# EAGLE design ina333 (EAGLE 8.2.2)
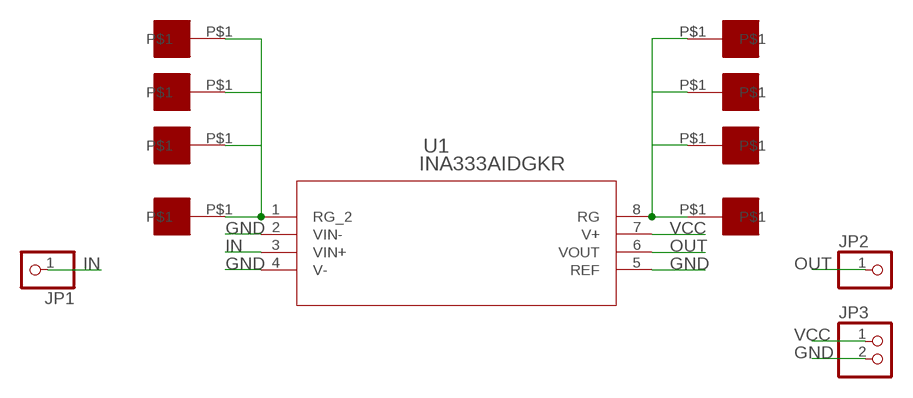
[diagram p0: schematic, sheet 1]

## Parts
JP1  PINHD-1X1  [1X01]
JP2  PINHD-1X1  [1X01]
JP3  PINHD-1X2  [1X02]
U1  INA333AIDGKR  [DGK8]
U$1  PAD  [PAD]
U$2  PAD  [PAD]
U$3  PAD  [PAD]
U$4  PAD  [PAD]
U$5  PAD  [PAD]
U$6  PAD  [PAD]
U$7  PAD  [PAD]
U$8  PAD  [PAD]

## Nets
GND: JP3.2 U1.2(VIN-) U1.4(V-) U1.5(REF)
IN: JP1.1 U1.3(VIN+)
N$1: U1.1(RG_2) U$1.P$1 U$3.P$1 U$5.P$1 U$6.P$1
N$2: U1.8(RG) U$2.P$1 U$4.P$1 U$7.P$1 U$8.P$1
OUT: JP2.1 U1.6(VOUT)
VCC: JP3.1 U1.7(V+)

## Library data of the parts
JP1 JP2 = pinhead:PINHD-1X1: PIN HEADER
JP3 = pinhead:PINHD-1X2: PIN HEADER
U1 = ina333:INA333AIDGKR; MANUFACTURER_PART_NUMBER: INA333AIDGKR; VENDOR: Texas Instruments
U$1-U$8 = pad:PAD

## Board
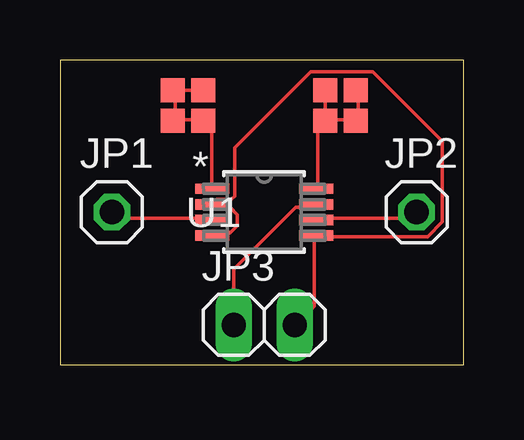
[diagram p1: board, top side]

Size 16.82 x 12.69 mm. Coordinates in mm from the lower left corner, seen from the top.
Outline: 0,0 16.82,0 16.82,12.69 0,12.69 0,0
Copper layers (1*16): Top 0.035mm / dielectric 1.5mm / Bottom 0.035mm
Design rules "default": minimum track width 6mil, minimum drill 0.35mm, track to track 6mil, track to pad 6mil, pad to pad 6mil, via to via 6mil, smd to smd 6mil, copper to edge 40mil, drill to drill 6mil, minimum pad ring 10mil, minimum via ring 8mil, stop-mask expansion 4mil, vias tented up to drill 0mil, thermal gap 10mil

### Footprints (pad centres in the part's own frame; a part is rotated, then mirrored left to right if it is on the bottom)
1X01 = drill 1.016 octagon: 1 0,0
1X02 = drill 1.016 long: 1 -1.27,0; 2 1.27,0
DGK8 = smd 1.422 x 0.432: 1 -2.172,0.975; 2 -2.172,0.325; 3 -2.172,-0.325; 4 -2.172,-0.975; 5 2.172,-0.975; 6 2.172,-0.325; 7 2.172,0.325; 8 2.172,0.975
PAD = smd 1 x 1: P$1 0,0

### Placement (x,y rotation side)
JP1  2.16,6.35 0 top
JP2  14.86,6.35 0 top
JP3  8.51,1.65 0 top
U1  8.51,6.35 0 top
U$1  4.7,10.16 0 top
U$2  12.32,10.16 0 top
U$3  4.7,11.43 0 top
U$4  12.32,11.43 0 top
U$5  5.97,10.16 0 top
U$6  5.97,11.43 0 top
U$7  11.05,10.16 0 top
U$8  11.05,11.43 0 top

### Tracks (layer width: path | path; a pad name or v marks a point on that pad's centre or on a via)
GND
  Top 0.152: U1.4 6.48,5.49 7.09,5.49 7.39,5.79 7.39,6.25 7.09,6.55 6.48,6.55 U1.2 6.54,6.88 7.14,6.88 7.28,7.01 7.28,9.03 10.44,12.19 13.03,12.19 15.93,9.3 15.93,5.94 15.32,5.33 10.74,5.33 U1.5 10.59,5.33 10.59,2.44 9.83,1.68 JP3.2
IN
  Top 0.152: U1.3 6.33,6.1 2.36,6.1 2.21,6.25 JP1.1
N$1
  Top 0.152: U$6.P$1 4.8,11.43 | 4.8,10.21 5.87,10.21 U$5.P$1 6.02,10.06 6.33,9.75 6.33,7.47 U1.1 | 4.8,10.21 4.8,11.43 | 4.8,11.43 U$3.P$1 | 4.8,10.21 U$1.P$1
N$2
  Top 0.152: U$4.P$1 12.42,11.43 12.42,10.21 U$2.P$1 12.27,10.21 11.05,10.21 | U$8.P$1 11.05,10.21 | U1.8 10.74,7.47 10.74,9.75 11.05,10.06 U$7.P$1 11.05,10.21
OUT
  Top 0.152: U1.6 10.74,6.1 14.71,6.1 14.86,6.25 JP2.1
VCC
  Top 0.152: JP3.1 7.24,3.96 9.83,6.55 10.59,6.55 U1.7